# Altium schematic sheet inmux.SCHDOC: 8+2 Acquisition Board
size B; Engineer: Eric Jonas (jonas@mwl.mit.edu); Organization: PILM, MIT; Address1: 46-5227; Address2: 43 Vassar St.; Address3: Cambridge, MA 02139; Address4: Australia 2086
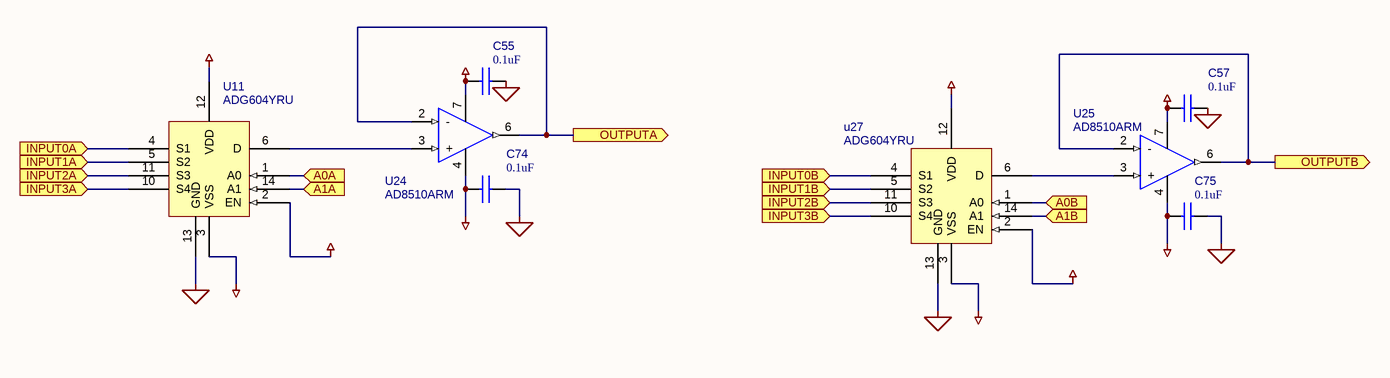
[diagram p0: inmux.SCHDOC]

## Parts
C55  value 0.1uF  [0603]  (hidden comment: CAPACITOR)
C57  value 0.1uF  [0603]  (hidden comment: CAPACITOR)
C74  value 0.1uF  [0603]  (hidden comment: CAPACITOR)
C75  value 0.1uF  [0603]  (hidden comment: CAPACITOR)
U11  ADG604YRU  [SSO-G14/X.4]
U24  AD8510ARM  [TSSO3X5-G8/X.4]
U25  AD8510ARM  [TSSO3X5-G8/X.4]
u27  ADG604YRU  [SSO-G14/X.4]

## Ports
A0A (in), A0B (in), A1A (in), A1B (in), INPUT0A (in), INPUT0B (in), INPUT1A (in), INPUT1B (in), INPUT2A (in), INPUT2B (in), INPUT3A (in), INPUT3B (in), OUTPUTA (out), OUTPUTB (out)

## Nets
AGND: C55.2 C57.2 C74.2 C75.2 U11.13(GND) u27.13(GND)
AVDD: C55.1 C57.1 U11.2(EN) U11.12(VDD) U24.7(+Vs) U25.7(+Vs) u27.2(EN) u27.12(VDD)
AVSS: C74.1 C75.1 U11.3(VSS) U24.4(-Vs) U25.4(-Vs) u27.3(VSS)
A0A: U11.1(A0) ; port A0A
A0B: u27.1(A0) ; port A0B
A1A: U11.14(A1) ; port A1A
A1B: u27.14(A1) ; port A1B
INPUT0A: U11.4(S1) ; port INPUT0A
INPUT0B: u27.4(S1) ; port INPUT0B
INPUT1A: U11.5(S2) ; port INPUT1A
INPUT1B: u27.5(S2) ; port INPUT1B
INPUT2A: U11.11(S3) ; port INPUT2A
INPUT2B: u27.11(S3) ; port INPUT2B
INPUT3A: U11.10(S4) ; port INPUT3A
INPUT3B: u27.10(S4) ; port INPUT3B
OUTPUTA: U24.2(-) U24.6(Out) ; port OUTPUTA
OUTPUTB: U25.2(-) U25.6(Out) ; port OUTPUTB
NetU11_6: U11.6(D) U24.3(+)
NetU25_3: U25.3(+) u27.6(D)

## Notes on the sheet
- Title:
- Engineer:
- Date:
- Revision:
- Sheet
- of
- File:

## Library data of the parts
C55 C57 C74 C75 = CAPACITOR: Standard Capacitor
U11 u27 = ADG604: 1 pC Charge Injection 100pA leakage CMOS 4-channel mux
U24 U25 = OP1177: Precision Low Noise, Low Input Bias Current Operational Amplifier; Vendor: Analog Devices